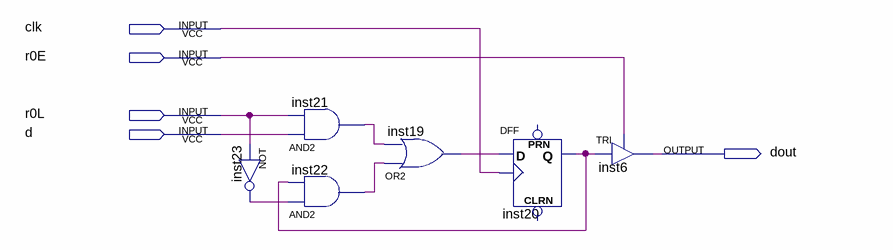
[diagram p0: schematic sheet]
// Quartus schematic r0.bdf as structural Verilog: 6 symbols, 5 pins
module r0 (
  input  clk,
  input  r0E,
  input  r0L,
  input  d,
  output dout
);

  wire inst19_out, inst20_q, inst21_out, inst22_out, inst23_out;

  and inst21 (inst21_out, d, r0L);
  not inst23 (inst23_out, r0L);
  and inst22 (inst22_out, inst23_out, inst20_q);
  or inst19 (inst19_out, inst22_out, inst21_out);
  DFF inst20 (.CLK(clk), .D(inst19_out), .Q(inst20_q));  // open: CLRN, PRN
  TRI inst6 (.IN(inst20_q), .OE(r0E), .OUT(dout));
endmodule
